# Altium project Sinewave PWM controller.PrjPcb
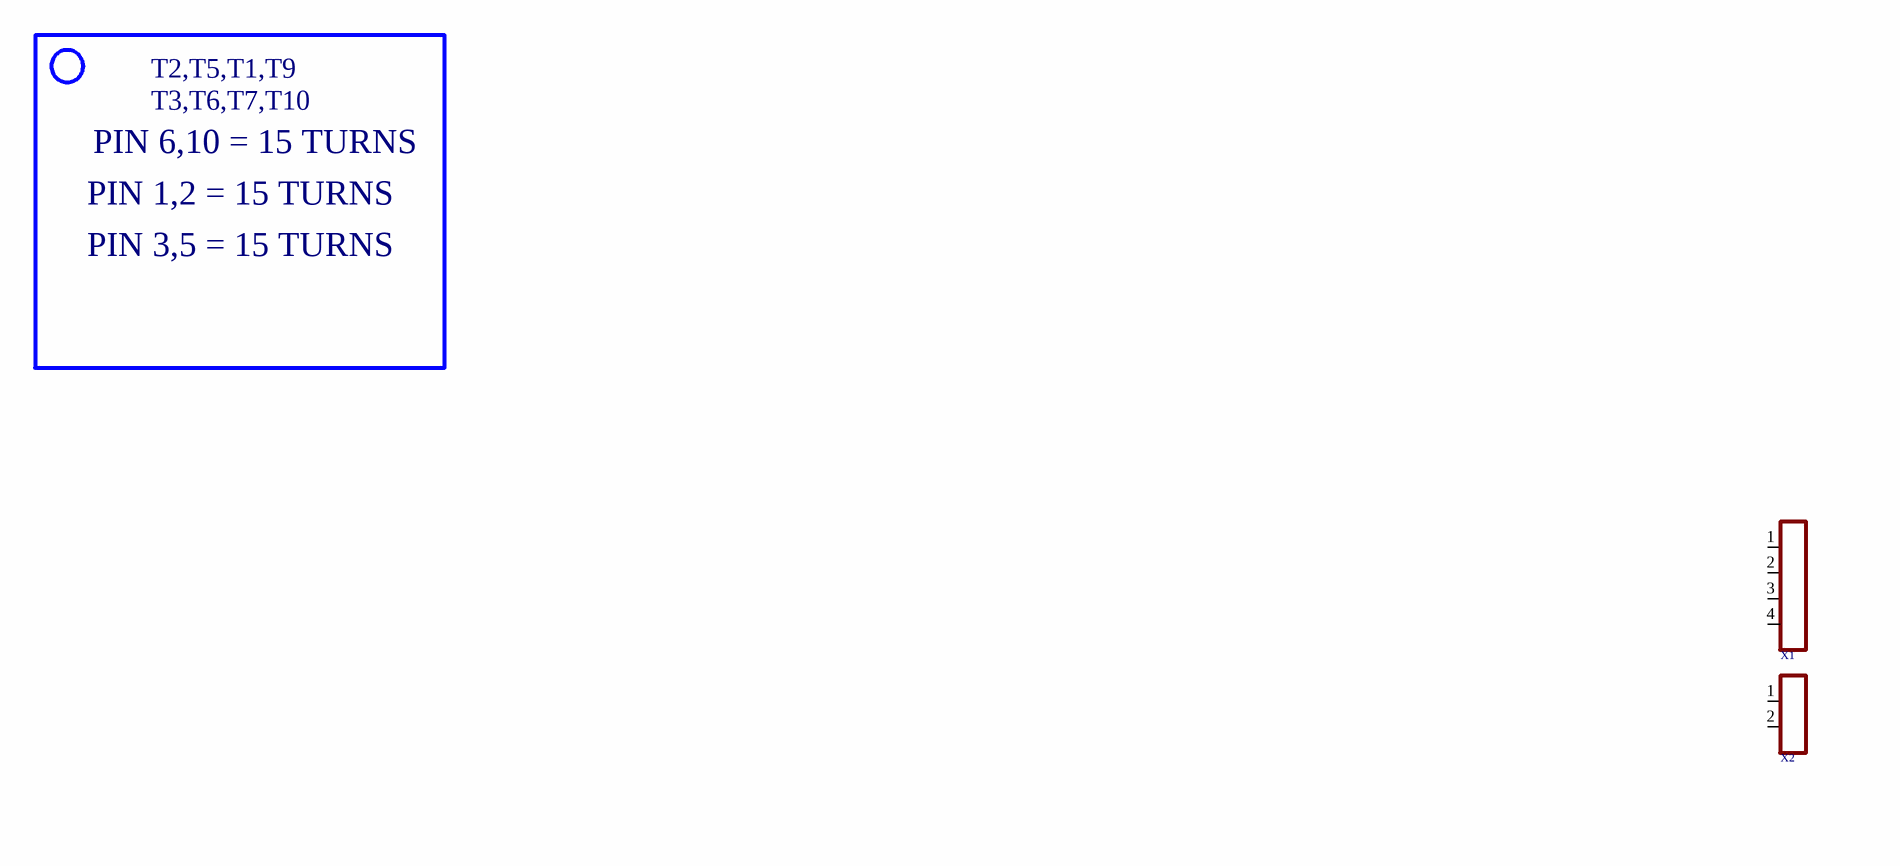
[diagram p0: Sinewave PWM controller.SchDoc, left]
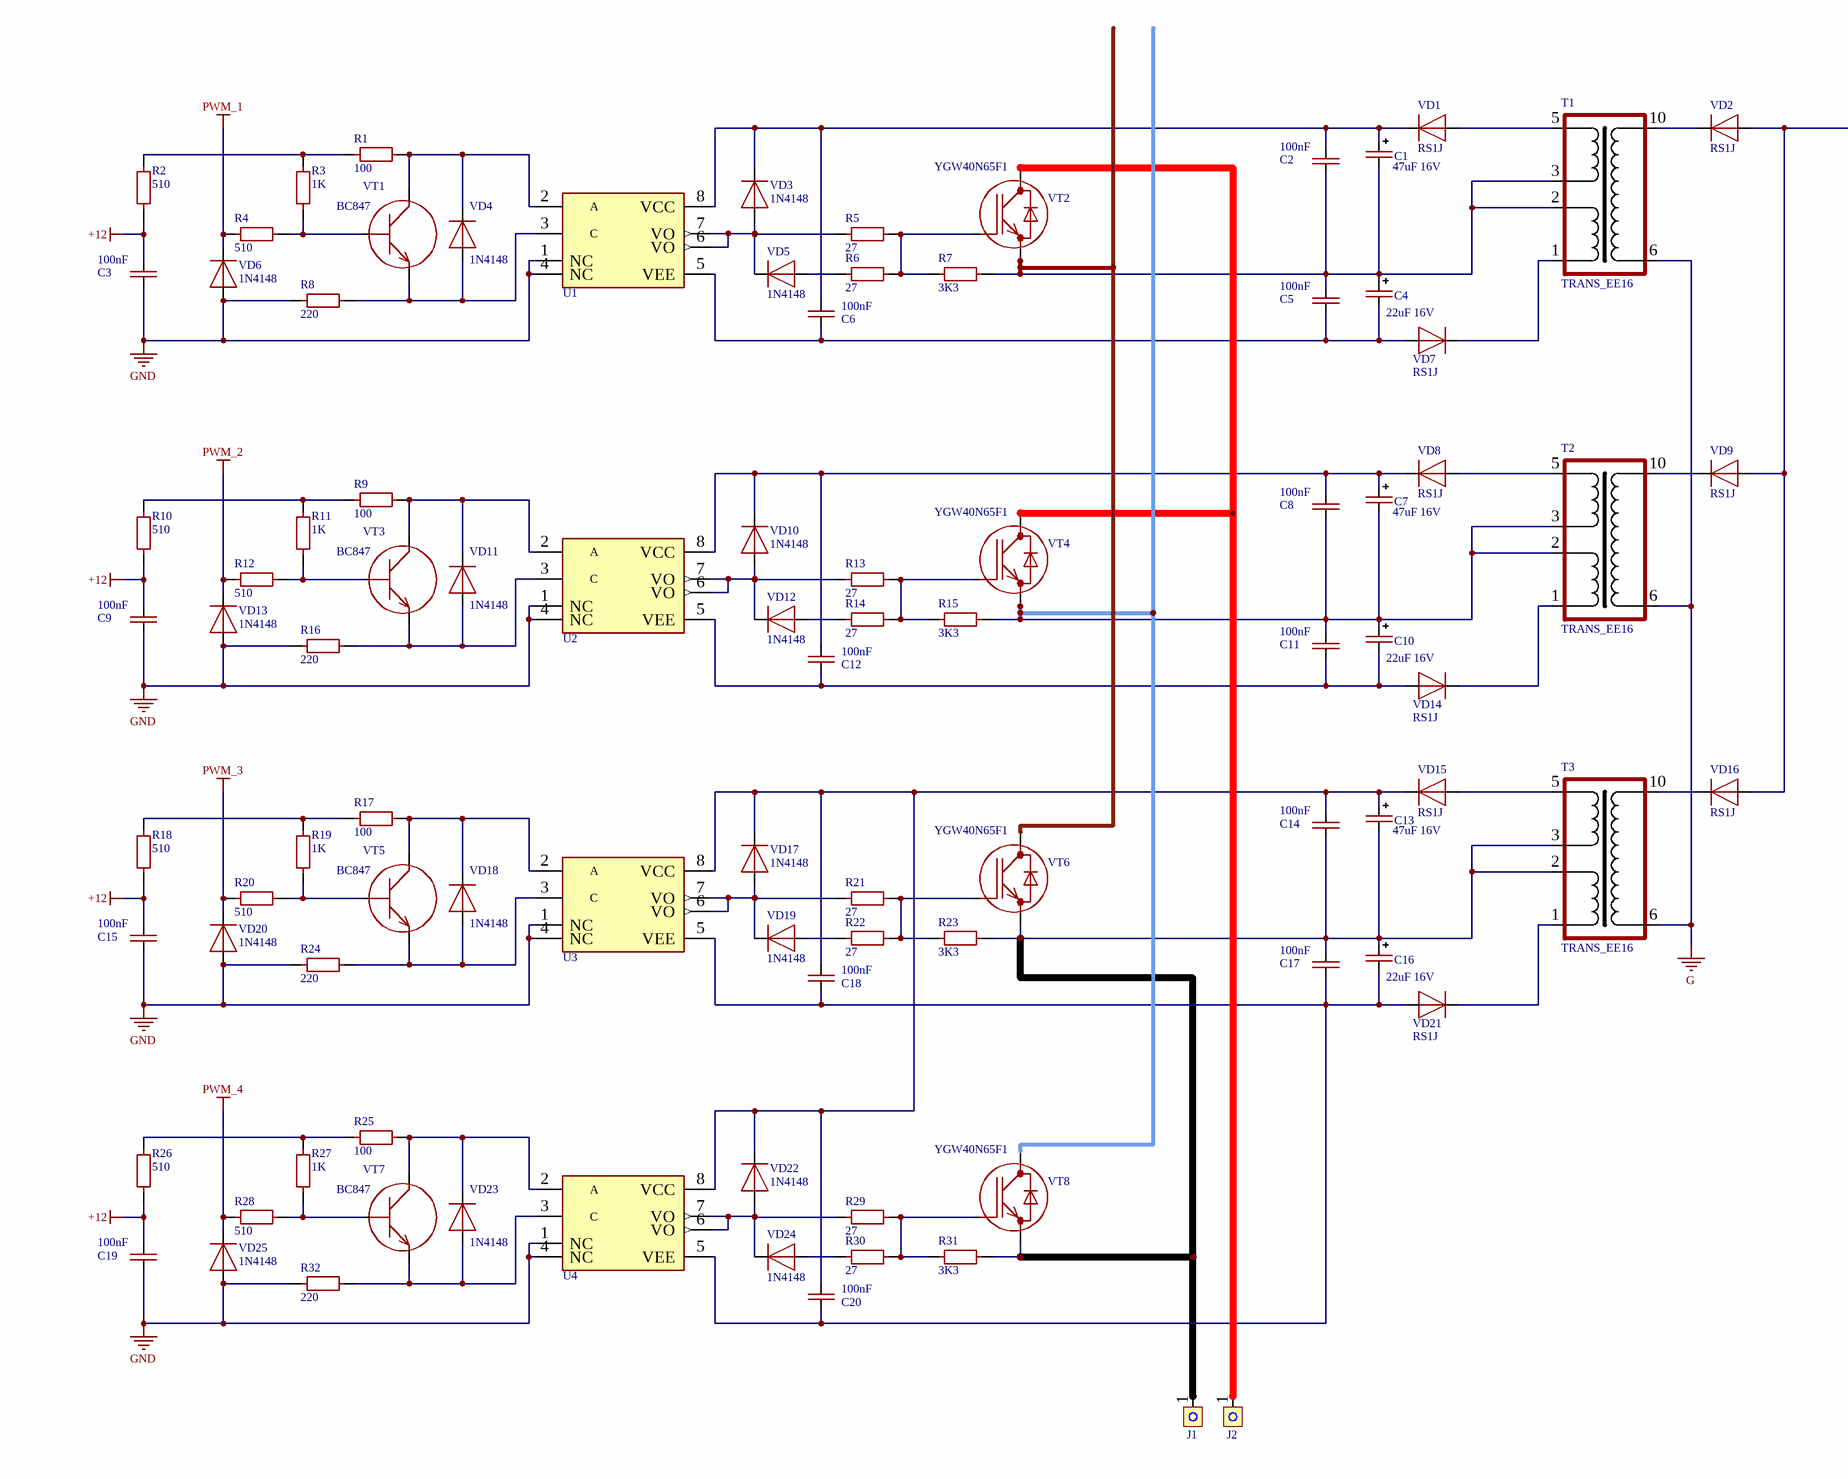
[diagram p1: Sinewave PWM controller.SchDoc, right]
1 sheet, 96 parts. Net scope: global (net labels, ports and power ports of the same name join across sheets).
Board file: Sinewave PWM controller.PcbDoc

## Sheet Sinewave PWM controller.SchDoc
size A0; SheetNumber: 1; SheetTotal: 1; SPICEModelCacheYQEDCYZF: <root> / <DocumentId>YQEDCYZF</DocumentId> / </root>

### Parts
C1  47uF 16V  [CAP-TAN-C]
C2  100nF  [CAP-1206]
C3  100nF  [CAP-1206]
C4  22uF 16V  [CAP-TAN-C]
C5  100nF  [CAP-1206]
C6  100nF  [CAP-1206]
C7  47uF 16V  [CAP-TAN-C]
C8  100nF  [CAP-1206]
C9  100nF  [CAP-1206]
C10  22uF 16V  [CAP-TAN-C]
C11  100nF  [CAP-1206]
C12  100nF  [CAP-1206]
C13  47uF 16V  [CAP-TAN-C]
C14  100nF  [CAP-1206]
C15  100nF  [CAP-1206]
C16  22uF 16V  [CAP-TAN-C]
C17  100nF  [CAP-1206]
C18  100nF  [CAP-1206]
C19  100nF  [CAP-1206]
C20  100nF  [CAP-1206]
J1  MG_136_HT  [Conn_MEIGAN_MG136HT]  (value not drawn)
J2  MG_136_HT  [Conn_MEIGAN_MG136HT]  (value not drawn)
R1  100  [RES-0805]
R2  510  [RES-0805]
R3  1K  [RES-0805]
R4  510  [RES-0805]
R5  27  [RES-0805]
R6  27  [RES-0805]
R7  3K3  [RES-0805]
R8  220  [RES-0805]
R9  100  [RES-0805]
R10  510  [RES-0805]
R11  1K  [RES-0805]
R12  510  [RES-0805]
R13  27  [RES-0805]
R14  27  [RES-0805]
R15  3K3  [RES-0805]
R16  220  [RES-0805]
R17  100  [RES-0805]
R18  510  [RES-0805]
R19  1K  [RES-0805]
R20  510  [RES-0805]
R21  27  [RES-0805]
R22  27  [RES-0805]
R23  3K3  [RES-0805]
R24  220  [RES-0805]
R25  100  [RES-0805]
R26  510  [RES-0805]
R27  1K  [RES-0805]
R28  510  [RES-0805]
R29  27  [RES-0805]
R30  27  [RES-0805]
R31  3K3  [RES-0805]
R32  220  [RES-0805]
T1  TRANS_EE16  [TRANS_EE16]
T2  TRANS_EE16  [TRANS_EE16]
T3  TRANS_EE16  [TRANS_EE16]
U1  HCPL-3120  [HCPL-3120]  (value not drawn)
U2  HCPL-3120  [HCPL-3120]  (value not drawn)
U3  HCPL-3120  [HCPL-3120]  (value not drawn)
U4  HCPL-3120  [HCPL-3120]  (value not drawn)
VD1  RS1J  [DO-214AC, SMA]
VD2  RS1J  [DO-214AC, SMA]
VD3  1N4148  [SOD-123]
VD4  1N4148  [SOD-123]
VD5  1N4148  [SOD-123]
VD6  1N4148  [SOD-123]
VD7  RS1J  [DO-214AC, SMA]
VD8  RS1J  [DO-214AC, SMA]
VD9  RS1J  [DO-214AC, SMA]
VD10  1N4148  [SOD-123]
VD11  1N4148  [SOD-123]
VD12  1N4148  [SOD-123]
VD13  1N4148  [SOD-123]
VD14  RS1J  [DO-214AC, SMA]
VD15  RS1J  [DO-214AC, SMA]
VD16  RS1J  [DO-214AC, SMA]
VD17  1N4148  [SOD-123]
VD18  1N4148  [SOD-123]
VD19  1N4148  [SOD-123]
VD20  1N4148  [SOD-123]
VD21  RS1J  [DO-214AC, SMA]
VD22  1N4148  [SOD-123]
VD23  1N4148  [SOD-123]
VD24  1N4148  [SOD-123]
VD25  1N4148  [SOD-123]
VT1  BC847  [SOT23-3]
VT2  YGW40N65F1  [TO-247-3]
VT3  BC847  [SOT23-3]
VT4  YGW40N65F1  [TO-247-3]
VT5  BC847  [SOT23-3]
VT6  YGW40N65F1  [TO-247-3]
VT7  BC847  [SOT23-3]
VT8  YGW40N65F1  [TO-247-3]
X1  CONN-4-PIN  [CONN-PLS-4-2.54mm_1]  (value not drawn)
X2  CONN-2-PIN  [XH2-]  (value not drawn)

### Nets
+12: C3.2 C9.2 C15.2 C19.2 R2.2 R10.2 R18.2 R26.2
G: T1.6 T2.6 T3.6
GND: C3.1 C9.1 C15.1 C19.1 R8.1 R16.1 R24.1 R32.1 U1.1(NC) U1.4(NC) U2.1(NC) U2.4(NC) U3.1(NC) U3.4(NC) U4.1(NC) U4.4(NC) VD6.2(A) VD13.2(A) VD20.2(A) VD25.2(A)
PWM_1: R4.1 VD6.1(C)
PWM_2: R12.1 VD13.1(C)
PWM_3: R20.1 VD20.1(C)
PWM_4: R28.1 VD25.1(C)
NetC1_1: C1.1(+) C2.2 C6.2 U1.8(VCC) VD1.1(C) VD3.1(C)
NetC1_2: C1.2(-) C2.1 C4.1(+) C5.2 R7.2 T1.2 T1.3 VT2.3(E) VT6.2(C)
NetC4_2: C4.2(-) C5.1 C6.1 U1.5(VEE) VD7.2(A)
NetC7_1: C7.1(+) C8.2 C12.2 U2.8(VCC) VD8.1(C) VD10.1(C)
NetC7_2: C7.2(-) C8.1 C10.1(+) C11.2 R15.2 T2.2 T2.3 VT4.3(E) VT8.2(C)
NetC10_2: C10.2(-) C11.1 C12.1 U2.5(VEE) VD14.2(A)
NetC13_1: C13.1(+) C14.2 C18.2 C20.2 U3.8(VCC) U4.8(VCC) VD15.1(C) VD17.1(C) VD22.1(C)
NetC13_2: C13.2(-) C14.1 C16.1(+) C17.2 J1.1 R23.2 R31.2 T3.2 T3.3 VT6.3(E) VT8.3(E)
NetC16_2: C16.2(-) C17.1 C18.1 C20.1 U3.5(VEE) U4.5(VEE) VD21.2(A)
NetJ2_1: J2.1 VT2.2(C) VT4.2(C)
NetR1_1: R1.1 R2.1 R3.2
NetR1_2: R1.2 U1.2(A) VD4.1(C) VT1.2(C)
NetR3_1: R3.1 R4.2 VT1.1(B)
NetR5_1: R5.1 U1.6(VO) U1.7(VO) VD3.2(A) VD5.1(C)
NetR5_2: R5.2 R6.2 R7.1 VT2.1(G)
NetR6_1: R6.1 VD5.2(A)
NetR8_2: R8.2 U1.3(C) VD4.2(A) VT1.3(E)
NetR9_1: R9.1 R10.1 R11.2
NetR9_2: R9.2 U2.2(A) VD11.1(C) VT3.2(C)
NetR11_1: R11.1 R12.2 VT3.1(B)
NetR13_1: R13.1 U2.6(VO) U2.7(VO) VD10.2(A) VD12.1(C)
NetR13_2: R13.2 R14.2 R15.1 VT4.1(G)
NetR14_1: R14.1 VD12.2(A)
NetR16_2: R16.2 U2.3(C) VD11.2(A) VT3.3(E)
NetR17_1: R17.1 R18.1 R19.2
NetR17_2: R17.2 U3.2(A) VD18.1(C) VT5.2(C)
NetR19_1: R19.1 R20.2 VT5.1(B)
NetR21_1: R21.1 U3.6(VO) U3.7(VO) VD17.2(A) VD19.1(C)
NetR21_2: R21.2 R22.2 R23.1 VT6.1(G)
NetR22_1: R22.1 VD19.2(A)
NetR24_2: R24.2 U3.3(C) VD18.2(A) VT5.3(E)
NetR25_1: R25.1 R26.1 R27.2
NetR25_2: R25.2 U4.2(A) VD23.1(C) VT7.2(C)
NetR27_1: R27.1 R28.2 VT7.1(B)
NetR29_1: R29.1 U4.6(VO) U4.7(VO) VD22.2(A) VD24.1(C)
NetR29_2: R29.2 R30.2 R31.1 VT8.1(G)
NetR30_1: R30.1 VD24.2(A)
NetR32_2: R32.2 U4.3(C) VD23.2(A) VT7.3(E)
NetT1_1: T1.1 VD7.1(C)
NetT1_5: T1.5 VD1.2(A)
NetT1_10: T1.10 VD2.1(C)
NetT2_1: T2.1 VD14.1(C)
NetT2_5: T2.5 VD8.2(A)
NetT2_10: T2.10 VD9.1(C)
NetT3_1: T3.1 VD21.1(C)
NetT3_5: T3.5 VD15.2(A)
NetT3_10: T3.10 VD16.1(C)
NetVD2_2: VD2.2(A) VD9.2(A) VD16.2(A)

Not connected (* = marked no-connect by the designer): X1 1 2 3 4; X2 1 2

### Notes on the sheet
- T2,T5,T1,T9
- T3,T6,T7,T10
- PIN 6,10 = 15 TURNS
- PIN 1,2 = 15 TURNS
- PIN 3,5 = 15 TURNS

### Library data of the parts
C1 C4 C7 C10 C13 C16 = CAP-POLAR
C2 C3 C5 C6 C8 C9 C11 C12 C14 C15 C17-C20 = CAP-NON-POLAR
J1 J2 = Connector_MEIGAN_MG136HT
R1-R32 = RES-CONST
VD1-VD25 = DIODE
VT1 VT3 VT5 VT7 = BIPOLAR-NPN-BEC
VT2 VT4 VT6 VT8 = IGBT-N-GCE